# Altium schematic sheet projection_test.SchDoc
size A; SheetNumber: 1; SheetTotal: 1
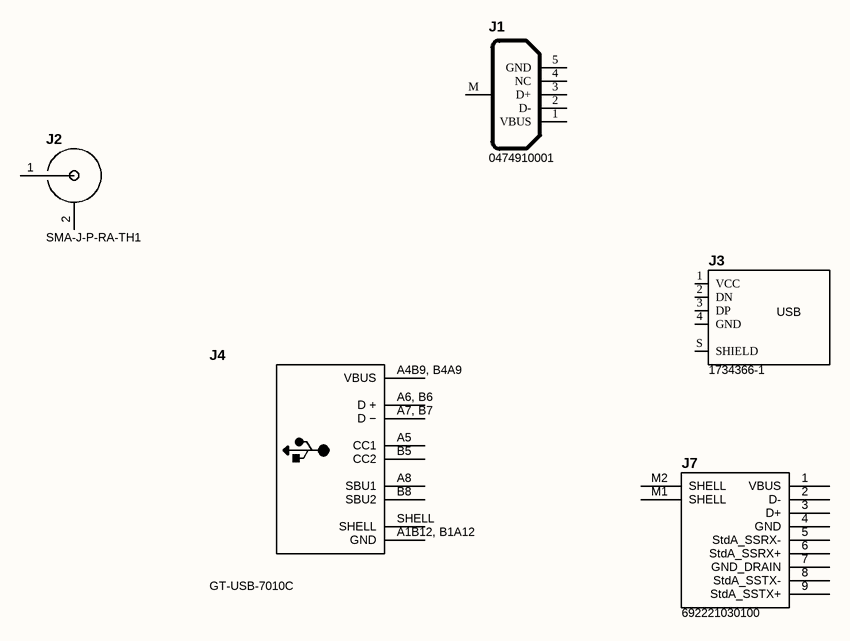
[diagram p0: projection_test.SchDoc]

## Parts
J1  0474910001  [0474910001]
J2  SMA-J-P-RA-TH1  [SMA-J-P-RA-TH1]
J3  1734366-1  [1734366-1]
J4  GT-USB-7010C  [GT-USB-7010C]
J7  692221030100  [692221030100]

## Nets

Not connected (* = marked no-connect by the designer): J1 1(VBUS) 2(D-) 3(D+) 4(NC) 5(GND) M(Tab); J2 1 2(GND); J3 1(VCC) 2(DN) 3(DP) 4(GND) S(SHIELD); J4 A1B12, B1A12(GND) A4B9, B4A9(VBUS) A5(CC1) A6, B6(D_+) A7, B7(D_−) A8(SBU1) B5(CC2) B8(SBU2) SHELL; J7 1(VBUS) 2(D-) 3(D+) 4(GND) 5(StdA_SSRX-) 6(StdA_SSRX+) 7(GND_DRAIN) 8(StdA_SSTX-) 9(StdA_SSTX+) M1(SHELL) M2(SHELL)

## Notes on the sheet
- (in symbol 1734366-1) USB 2.0 / TYPE A

## Library data of the parts
J1 = 0474910001: CONN RCPT MICRO USB B 5POS SMD; panel_monkey__part_id: 019dd87a-1e57-7a8a-92bd-da6fed6add49; mfg: Molex; panel_monkey__version_id: 019dd87a-1e57-74fe-adfa-d5875d5553d4; panel_monkey__generated_schlib_path: symbols/0474910001-019dd87a.SchLib; Value: 0474910001; mpn: 0474910001; panel_monkey__source_handle: 0474910001; panel_monkey__source_symbol_ref: 0474910001; panel_monkey__generated_symbol_ref: 0474910001
J2 = SMA-J-P-RA-TH1: CONN SMA JACK R/A 50 OHM PCB; panel_monkey__part_id: 019dd87a-39de-7efc-aa89-54c41345879b; mfg: Samtec; panel_monkey__version_id: 019dd87a-39de-7228-94cb-6c88eee9c425; panel_monkey__generated_schlib_path: symbols/SMA-J-P-RA-TH1-019dd87a.SchLib; Value: SMA-J-P-RA-TH1; Supplier 1: JLCPCB; Supplier Part Number 1: C6488932; Supplier Provider Name 1: jlcpcb; mpn: SMA-J-P-RA-TH1; panel_monkey__source_handle: SMA-J-P-RA-TH1; panel_monkey__source_symbol_ref: SMA-J-P-RA-TH1; panel_monkey__generated_symbol_ref: SMA-J-P-RA-TH1
J3 = 1734366-1: CONN RCPT USB2.0 TYPEA 4POS VERT; panel_monkey__part_id: 019dd87a-1e83-71b4-bbe4-4e204144c237; mfg: TE Connectivity AMP Connectors; panel_monkey__version_id: 019dd87a-1e83-79fc-a6a6-3f77b21c2f7a; panel_monkey__generated_schlib_path: symbols/1734366-1-019dd87a.SchLib; Value: 1734366-1; mpn: 1734366-1; panel_monkey__source_handle: 1734366-1; panel_monkey__source_symbol_ref: 1734366-1; panel_monkey__generated_symbol_ref: 1734366-1
J4 = GT-USB-7010C: USB-C Right Angle - USB2.0 Pinout; panel_monkey__part_id: 019dd87a-3577-74e9-8358-92d0a8817abb; mfg: G-Switch; panel_monkey__version_id: 019dd87a-3577-7d77-b357-d0310081ab4f; panel_monkey__generated_schlib_path: symbols/GT-USB-7010C-019dd87a.SchLib; Value: GT-USB-7010C; Supplier 1: JLCPCB; Supplier Part Number 1: C2843967; Supplier Provider Name 1: jlcpcb; mpn: GT-USB-7010C; panel_monkey__source_handle: GT-USB-7010C; panel_monkey__source_symbol_ref: GT-USB-7010C; panel_monkey__generated_symbol_ref: GT-USB-7010C
J7 = 692221030100: CONN RCPT USB3.0 TYPEB 9POS R/A; panel_monkey__part_id: 019dd87a-1eb4-7176-90fa-f6390bc8c3e3; mfg: Würth Elektronik; panel_monkey__version_id: 019dd87a-1eb4-759a-9361-ab0fb20aae16; panel_monkey__generated_schlib_path: symbols/692221030100-019dd87a.SchLib; Value: 692221030100; mpn: 692221030100; panel_monkey__source_handle: 692221030100; panel_monkey__source_symbol_ref: 692221030100; panel_monkey__generated_symbol_ref: 692221030100